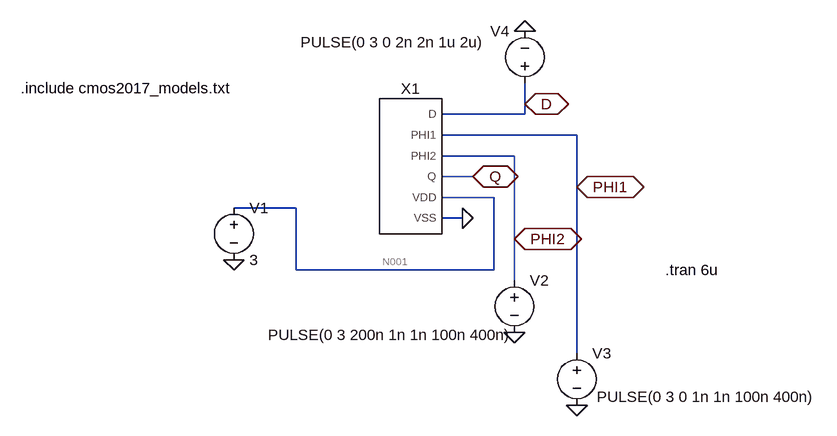
[diagram p0: schematic DFlipFlop_test_bench.asc]
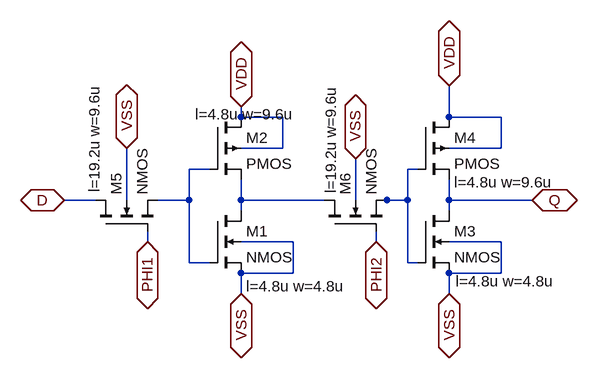
[diagram p1: sub-circuit dflipflop.asc]
DFlipFlop_test_bench.asc, the LTspice schematic file:
Version 4
SHEET 1 880 680
WIRE 352 64 352 32
WIRE 352 80 352 64
WIRE 352 80 224 80
WIRE 432 112 224 112
WIRE 336 144 224 144
WIRE 272 176 224 176
WIRE 432 192 432 112
WIRE 304 208 224 208
WIRE 0 224 -96 224
WIRE 256 240 224 240
WIRE 336 272 336 144
WIRE 0 320 0 224
WIRE 304 320 304 208
WIRE 304 320 0 320
WIRE 336 336 336 272
WIRE 432 448 432 192
FLAG -96 304 0
FLAG 336 416 0
FLAG 432 528 0
FLAG 272 176 Q
IOPIN 272 176 BiDir
FLAG 352 -48 0
FLAG 352 64 D
IOPIN 352 64 BiDir
FLAG 432 192 PHI1
IOPIN 432 192 BiDir
FLAG 336 272 PHI2
IOPIN 336 272 BiDir
FLAG 256 240 0
SYMBOL DFlipFlop 176 160 R0
SYMATTR InstName X1
SYMBOL voltage -96 208 R0
WINDOW 123 0 0 Left 2
WINDOW 39 0 0 Left 2
SYMATTR InstName V1
SYMATTR Value 3
SYMBOL voltage 336 320 R0
WINDOW 123 0 0 Left 2
WINDOW 39 0 0 Left 2
WINDOW 3 -379 100 Left 2
SYMATTR InstName V2
SYMATTR Value PULSE(0 3 200n 1n 1n 100n 400n)
SYMBOL voltage 432 432 R0
WINDOW 123 0 0 Left 2
WINDOW 39 0 0 Left 2
WINDOW 3 31 83 Left 2
SYMATTR InstName V3
SYMATTR Value PULSE(0 3 0 1n 1n 100n 400n)
SYMBOL voltage 352 48 R180
WINDOW 0 24 96 Left 2
WINDOW 3 62 79 Left 2
WINDOW 123 0 0 Left 2
WINDOW 39 0 0 Left 2
SYMATTR InstName V4
SYMATTR Value PULSE(0 3 0 2n 2n 1u 2u)
TEXT 568 320 Left 2 !.tran 6u
TEXT -424 40 Left 2 !.include cmos2017_models.txt

dflipflop.asc, the sub-circuit schematic file:
Version 4
SHEET 1 880 680
WIRE 128 16 128 0
WIRE 192 16 128 16
WIRE 448 16 448 -32
WIRE 528 16 448 16
WIRE 192 64 192 16
WIRE 192 64 128 64
WIRE 528 64 528 16
WIRE 528 64 448 64
WIRE 80 96 48 96
WIRE 400 96 384 96
WIRE -96 144 -144 144
WIRE -48 144 -48 64
WIRE 48 144 48 96
WIRE 48 144 0 144
WIRE 128 144 128 112
WIRE 256 144 128 144
WIRE 304 144 304 80
WIRE 352 144 336 144
WIRE 384 144 384 96
WIRE 384 144 352 144
WIRE 448 144 448 112
WIRE 576 144 448 144
WIRE 128 160 128 144
WIRE 448 160 448 144
WIRE -16 208 -16 192
WIRE 208 208 128 208
WIRE 336 208 336 192
WIRE 528 208 448 208
WIRE 48 240 48 144
WIRE 80 240 48 240
WIRE 384 240 384 144
WIRE 400 240 384 240
WIRE 208 256 208 208
WIRE 208 256 128 256
WIRE 528 256 528 208
WIRE 528 256 448 256
WIRE 128 288 128 256
WIRE 448 288 448 256
FLAG 128 0 VDD
IOPIN 128 0 BiDir
FLAG 448 -32 VDD
IOPIN 448 -32 BiDir
FLAG 336 208 PHI2
IOPIN 336 208 BiDir
FLAG -16 208 PHI1
IOPIN -16 208 BiDir
FLAG 576 144 Q
IOPIN 576 144 BiDir
FLAG -144 144 D
IOPIN -144 144 BiDir
FLAG -48 64 VSS
IOPIN -48 64 BiDir
FLAG 304 80 VSS
IOPIN 304 80 BiDir
FLAG 448 288 VSS
IOPIN 448 288 BiDir
FLAG 128 288 VSS
IOPIN 128 288 BiDir
SYMBOL nmos4 80 160 R0
WINDOW 123 56 116 Left 2
SYMATTR Value2 l=4.8u w=4.8u
SYMATTR InstName M1
SYMBOL pmos4 80 16 R0
WINDOW 123 -23 -4 Left 2
SYMATTR Value2 l=4.8u w=9.6u
SYMATTR InstName M2
SYMBOL nmos4 400 160 R0
WINDOW 123 58 109 Left 2
SYMATTR Value2 l=4.8u w=4.8u
SYMATTR InstName M3
SYMBOL pmos4 400 16 R0
WINDOW 123 56 100 Left 2
SYMATTR Value2 l=4.8u w=9.6u
SYMATTR InstName M4
SYMBOL nmos4 -96 192 R270
WINDOW 123 60 -2 Left 2
SYMATTR Value2 l=19.2u w=9.6u
SYMATTR InstName M5
SYMBOL nmos4 256 192 R270
WINDOW 123 58 10 Left 2
SYMATTR Value2 l=19.2u w=9.6u
SYMATTR InstName M6

The netlist it stands for:
* DFlipFlop_test_bench.asc
XX1 D PHI1 PHI2 Q N001 0 dflipflop
V1 N001 0 3
V2 PHI2 0 PULSE(0 3 200n 1n 1n 100n 400n)
V3 PHI1 0 PULSE(0 3 0 1n 1n 100n 400n)
V4 D 0 PULSE(0 3 0 2n 2n 1u 2u)

* block symbol definitions
.subckt dflipflop D PHI1 PHI2 Q VDD VSS
M1 N003 N001 VSS VSS NMOS l=4.8u w=4.8u
M2 VDD N001 N003 VDD PMOS l=4.8u w=9.6u
M3 Q N002 VSS VSS NMOS l=4.8u w=4.8u
M4 VDD N002 Q VDD PMOS l=4.8u w=9.6u
M5 D PHI1 N001 VSS NMOS l=19.2u w=9.6u
M6 N003 PHI2 N002 VSS NMOS l=19.2u w=9.6u
.ends dflipflop

.model NMOS NMOS
.model PMOS PMOS
.lib standard.mos
.tran 6u
.include cmos2017_models.txt
.backanno
.end

* Results of the author's LTspice run, read from the files saved beside the schematic
* Operating Point, zero values left out:
*   V(n001) = 3 V
*   V(q) = 867 mV
*   I(V1) = -100.9 µA
*   Ix(x1:VDD) = 100.9 µA
*   Ix(x1:VSS) = -100.9 µA
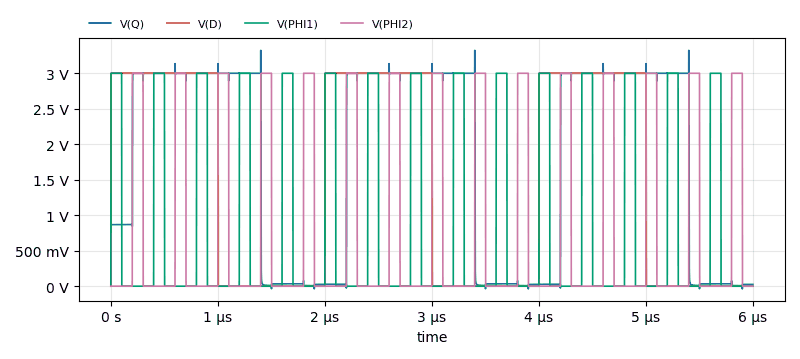
[diagram p2: Transient Analysis of DFlipFlop_test_bench.asc, plotted from the saved traces]
* Transient Analysis, 1 run:
*   V(Q): min -36.83 mV, max 3.323 V, average 1.84 V, rms 2.33 V, last 25.6 mV
*   V(D): min 0 V, max 3 V, average 1.503 V, rms 2.123 V, last 0 V
*   V(PHI1): min 0 V, max 3 V, average 757.5 mV, rms 1.505 V, last 0 V
*   V(PHI2): min 0 V, max 3 V, average 757.5 mV, rms 1.505 V, last 0 V